# Altium schematic sheet Sheet3.SchDoc
size A
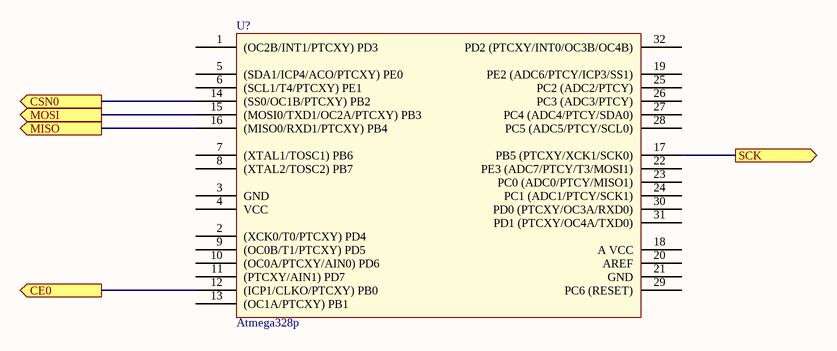
[diagram p0: Sheet3.SchDoc]

## Parts
U?  Atmega328p  [TQFP80P900X900X120-32N]

## Ports
CE0 (out), CSN0 (out), MISO (out), MOSI (out), SCK (out)

## Nets
CE0: U?.12((ICP1/CLKO/PTCXY)_PB0) ; port CE0
CSN0: U?.14((SS0/OC1B/PTCXY)_PB2) ; port CSN0
MISO: U?.16((MISO0/RXD1/PTCXY)_PB4) ; port MISO
MOSI: U?.15((MOSI0/TXD1/OC2A/PTCXY)_PB3) ; port MOSI
SCK: U?.17(PB5_(PTCXY/XCK1/SCK0)) ; port SCK

Not connected (* = marked no-connect by the designer): U? 1((OC2B/INT1/PTCXY)_PD3) 2((XCK0/T0/PTCXY)_PD4) 3(GND) 4(VCC) 5((SDA1/ICP4/ACO/PTCXY)_PE0) 6((SCL1/T4/PTCXY)_PE1) 7((XTAL1/TOSC1)_PB6) 8((XTAL2/TOSC2)_PB7) 9((OC0B/T1/PTCXY)_PD5) 10((OC0A/PTCXY/AIN0)_PD6) 11((PTCXY/AIN1)_PD7) 13((OC1A/PTCXY)_PB1) 18(A_VCC) 19(PE2_(ADC6/PTCY/ICP3/SS1)) 20(AREF) 21(GND) 22(PE3_(ADC7/PTCY/T3/MOSI1)) 23(PC0_(ADC0/PTCY/MISO1)) 24(PC1_(ADC1/PTCY/SCK1)) 25(PC2_(ADC2/PTCY)) 26(PC3_(ADC3/PTCY)) 27(PC4_(ADC4/PTCY/SDA0)) 28(PC5_(ADC5/PTCY/SCL0)) 29(PC6_(RESET)) 30(PD0_(PTCXY/OC3A/RXD0)) 31(PD1_(PTCXY/OC4A/TXD0)) 32(PD2_(PTCXY/INT0/OC3B/OC4B))

## Library data of the parts
U? = Atmega329p